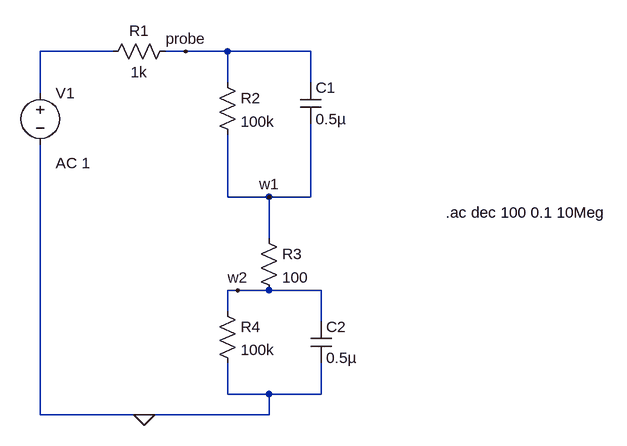
[diagram p0: schematic electrode_floor.asc]
electrode_floor.asc, the LTspice schematic file:
Version 4.1
SHEET 1 968 680
WIRE 192 32 80 32
WIRE 304 32 272 32
WIRE 368 32 304 32
WIRE 496 32 368 32
WIRE 368 80 368 32
WIRE 496 80 496 32
WIRE 80 96 80 32
WIRE 368 256 368 160
WIRE 432 256 368 256
WIRE 496 256 496 144
WIRE 496 256 432 256
WIRE 432 320 432 256
WIRE 384 400 368 400
WIRE 432 400 384 400
WIRE 512 400 432 400
WIRE 368 432 368 400
WIRE 512 448 512 400
WIRE 368 560 368 512
WIRE 432 560 368 560
WIRE 512 560 512 512
WIRE 512 560 432 560
WIRE 80 592 80 176
WIRE 240 592 80 592
WIRE 432 592 432 560
WIRE 432 592 240 592
FLAG 304 32 probe
FLAG 432 256 w1
FLAG 384 400 w2
FLAG 240 592 0
SYMBOL voltage 80 80 R0
WINDOW 123 24 124 Left 2
WINDOW 39 0 0 Left 0
SYMATTR InstName V1
SYMATTR Value ""
SYMATTR Value2 AC 1
SYMBOL res 288 16 R90
WINDOW 0 0 56 VBottom 2
WINDOW 3 32 56 VTop 2
SYMATTR InstName R1
SYMATTR Value 1k
SYMBOL res 352 64 R0
SYMATTR InstName R2
SYMATTR Value 100k
SYMBOL cap 480 80 R0
SYMATTR InstName C1
SYMATTR Value 0.5µ
SYMBOL res 416 304 R0
SYMATTR InstName R3
SYMATTR Value 100
SYMBOL res 352 416 R0
SYMATTR InstName R4
SYMATTR Value 100k
SYMBOL cap 496 448 R0
SYMATTR InstName C2
SYMATTR Value 0.5µ
TEXT 704 280 Left 2 !.ac dec 100 0.1 10Meg

The netlist it stands for:
* electrode_floor.asc
V1 N001 0 AC 1
R1 probe N001 1k
R2 probe w1 100k
C1 probe w1 0.5µ
R3 w1 w2 100
R4 w2 0 100k
C2 w2 0 0.5µ
.ac dec 100 0.1 10Meg
.backanno
.end